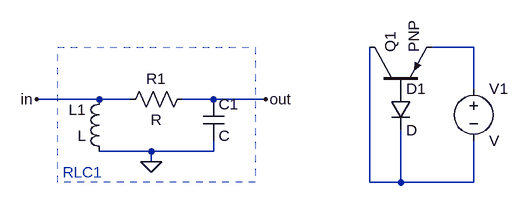
[diagram p0: schematic RLC_test2.asc]
RLC_test2.asc, the LTspice schematic file:
Version 4.1
SHEET 1 1032 680
WIRE 608 32 544 32
WIRE 608 96 608 32
WIRE 32 112 -64 112
WIRE 80 112 32 112
WIRE 208 112 160 112
WIRE 288 112 208 112
WIRE 112 192 32 192
WIRE 208 192 208 176
WIRE 208 192 112 192
WIRE 112 208 112 192
WIRE 448 240 448 32
WIRE 496 240 496 160
WIRE 496 240 448 240
WIRE 608 240 608 176
WIRE 608 240 496 240
FLAG -64 112 in
FLAG 288 112 out
FLAG 112 208 0
SYMBOL res 176 96 R90
WINDOW 0 0 56 VBottom 2
WINDOW 3 32 56 VTop 2
SYMATTR InstName R1
SYMBOL cap 192 112 R0
SYMATTR InstName C1
SYMBOL ind 48 208 R180
WINDOW 0 36 80 Left 2
WINDOW 3 36 40 Left 2
SYMATTR InstName L1
SYMBOL diode 480 96 R0
SYMATTR InstName D1
SYMBOL pnp 448 96 R270
SYMATTR InstName Q1
SYMBOL voltage 608 80 R0
SYMATTR InstName V1
TEXT -24 224 Left 2 ;RLC1
RECTANGLE Normal 272 240 -32 32 2

The netlist it stands for:
* RLC_test2.asc
R1 out in R
C1 out 0 C
L1 0 in L
D1 P001 N002 D
Q1 N002 P001 N001 0 PNP
V1 N001 N002 V
.model D D
.lib standard.dio
.model NPN NPN
.model PNP PNP
.lib standard.bjt
* RLC1
.backanno
.end